# Altium schematic sheet 1_MCU.SchDoc: Untitled
size A3; CompanyName: Tsuru Robotics; Organization: Tsuru Robotics; Revision: -1
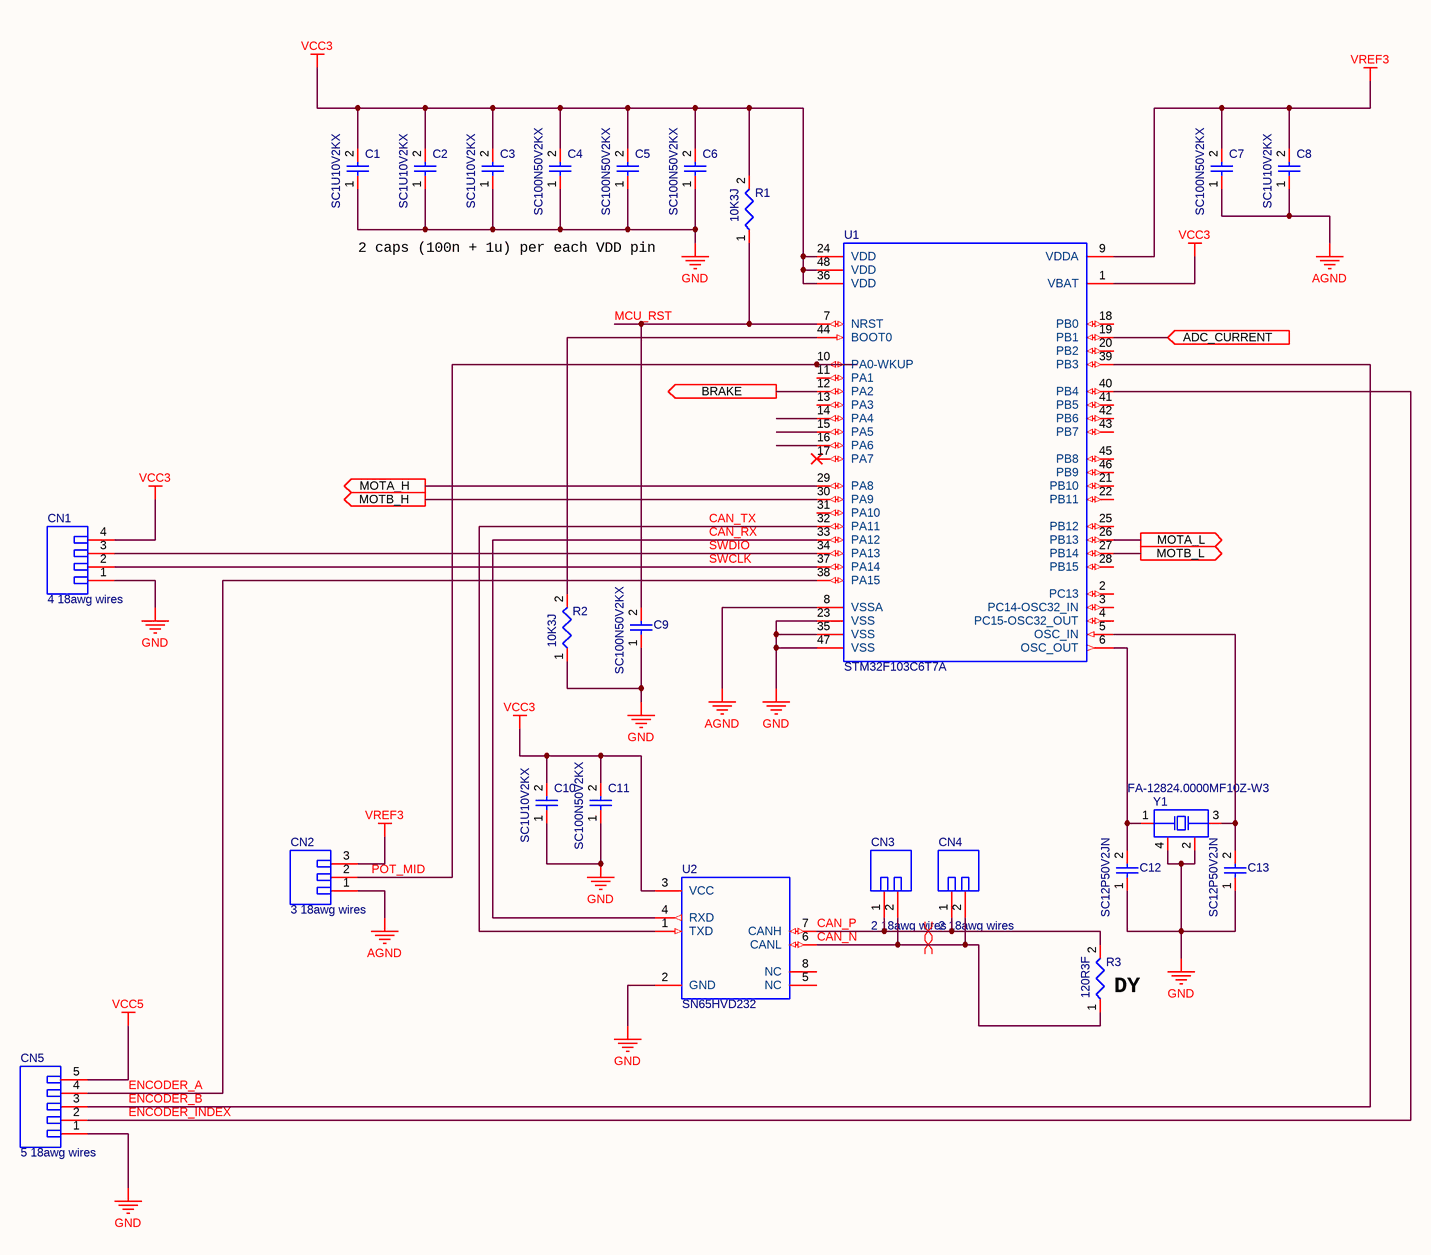
[diagram p0: 1_MCU.SchDoc]

## Parts
C1  SC1U10V2KX  [CAPC0402(1005)60_L]
C2  SC1U10V2KX  [CAPC0402(1005)60_L]
C3  SC1U10V2KX  [CAPC0402(1005)60_L]
C4  SC100N50V2KX  [CAPC0402(1005)60_L]
C5  SC100N50V2KX  [CAPC0402(1005)60_L]
C6  SC100N50V2KX  [CAPC0402(1005)60_L]
C7  SC100N50V2KX  [CAPC0402(1005)60_L]
C8  SC1U10V2KX  [CAPC0402(1005)60_L]
C9  SC100N50V2KX  [CAPC0402(1005)60_L]
C10  SC1U10V2KX  [CAPC0402(1005)60_L]
C11  SC100N50V2KX  [CAPC0402(1005)60_L]
C12  SC12P50V2JN  [CAPC0402(1005)33_L]
C13  SC12P50V2JN  [CAPC0402(1005)33_L]
CN1  4 18awg wires  [4PHEADERS-2D54]  (no BOM)
CN2  3 18awg wires  [3PHEADERS-2D54]  (no BOM)
CN3  2 18awg wires  [2PHEADERS-2D54]  (no BOM)
CN4  2 18awg wires  [2PHEADERS-2D54]  (no BOM)
CN5  5 18awg wires  [5PHEADERS-2D54]  (no BOM)
R1  10K3J  [RESC0603(1608)_L]
R2  10K3J  [RESC0603(1608)_L]
R3  120R3F  [RESC0603(1608)_L]
U1  STM32F103C6T7A  [TSQFP50P900X900X160-48L]
U2  SN65HVD232  [SOIC127P600X175-8L]
Y1  FA-12824.0000MF10Z-W3  [QRTZ-12mhz]

## Ports
ADC_CURRENT (in), BRAKE (out), MOTA_H (out), MOTA_L (out), MOTB_H (out), MOTB_L (out)

## Nets
AGND: C7.1 C8.1 CN2.1 U1.8(VSSA)
GND: C1.1 C2.1 C3.1 C4.1 C5.1 C6.1 C9.1 C10.1 C11.1 C12.1 C13.1 CN1.1 CN5.1 R2.1 U1.23(VSS) U1.35(VSS) U1.47(VSS) U2.2(GND) Y1.2(NC) Y1.4(NC)
VCC3: C1.2 C2.2 C3.2 C4.2 C5.2 C6.2 C10.2 C11.2 CN1.4 R1.2 U1.1(VBAT) U1.24(VDD) U1.36(VDD) U1.48(VDD) U2.3(VCC)
VCC5: CN5.5
VREF3: C7.2 C8.2 CN2.3 U1.9(VDDA)
ADC_CURRENT: U1.19(PB1) ; port ADC_CURRENT
BRAKE: U1.12(PA2) ; port BRAKE
CAN_N: CN3.2 CN4.2 R3.1 U2.6(CANL)
CAN_P: CN3.1 CN4.1 R3.2 U2.7(CANH)
CAN_RX: U1.33(PA12) U2.4(RXD)
CAN_TX: U1.32(PA11) U2.1(TXD)
ENCODER_A: CN5.4 U1.38(PA15)
ENCODER_B: CN5.3 U1.39(PB3)
ENCODER_INDEX: CN5.2 U1.40(PB4)
MCU_RST: C9.2 R1.1 U1.7(NRST)
MOTA_H: U1.29(PA8) ; port MOTA_H
MOTA_L: U1.26(PB13) ; port MOTA_L
MOTB_H: U1.30(PA9) ; port MOTB_H
MOTB_L: U1.27(PB14) ; port MOTB_L
POT_MID: CN2.2 U1.10(PA0-WKUP)
SWCLK: CN1.2 U1.37(PA14)
SWDIO: CN1.3 U1.34(PA13)
NetC12_2: C12.2 U1.6(OSC_OUT) Y1.1(X1)
NetC13_2: C13.2 U1.5(OSC_IN) Y1.3(X2)
NetR2_2: R2.2 U1.44(BOOT0)

Not connected (* = marked no-connect by the designer): U1 2(PC13) 3(PC14-OSC32_IN) 4(PC15-OSC32_OUT) 11(PA1) 13(PA3) 14(PA4) 15(PA5) 16(PA6) 17(PA7)* 18(PB0) 20(PB2) 21(PB10) 22(PB11) 25(PB12) 28(PB15) 31(PA10) 41(PB5) 42(PB6) 43(PB7) 45(PB8) 46(PB9); U2 5(NC) 8(NC)

## Layout directives
differential pair: CAN_P
differential pair; differential pair class *: CAN_N

## Notes on the sheet
- 2 caps (100n + 1u) per each VDD pin
- (near R3) DY
- Title
- Size:
- Date:
- A3
- Number:
- Time:
- Revision:
- Sheet
- of
- File:

## Library data of the parts
C1-C3 C8 C10 = CAP(0402)1UF10V: CAP 1uF 10V ±10% 0402 (1005 Metric) Thickness 0.6mm SMD
C4-C7 C9 C11 = CAP(0402)100nF50V: CAP 100nF 50V ±10% 0402 (1005 Metric) Thickness 0.6mm SMD
C12 C13 = CAP12pF: CAP 12pF 50V ±5% 0402 (1005 Metric) Thickness 0.33mm SMD
CN1 = 4PIN-CN: 4 holes for 18awg wire; Manufacturer: JST; Datasheet URL: http://www.jst-mfg.com/product/pdf/eng/eGH.pdf; Package Reference: JST-BM04B-GHS-TBT
CN2 = 3PIN-CN: 3 holes for 18awg wire; Manufacturer: JST; Datasheet URL: http://www.jst-mfg.com/product/pdf/eng/eGH.pdf; Package Reference: JST-BM04B-GHS-TBT
CN3 CN4 = 2PIN-CN: 2 holes for 18awg wire; Manufacturer: JST; Datasheet URL: http://www.jst-mfg.com/product/pdf/eng/eGH.pdf; Package Reference: JST-BM04B-GHS-TBT
CN5 = 5PIN-CN: 5 holes for 18awg wire; Manufacturer: JST; Datasheet URL: http://www.jst-mfg.com/product/pdf/eng/eGH.pdf; Package Reference: JST-BM04B-GHS-TBT
R1 R2 = RES0(0603)_10K: 10K 0.1W 5% 0603 (1608 Metric)  SMD
R3 = RES0(0603)_120R: 100R 0.1W 1% 0603 (1608 Metric)  SMD
U1 = STM32F103C6T7A: ARM® Cortex®-M3 STM32F1 Microcontroller IC 32-Bit 72MHz 32KB 48-LFQP (7x7); Supply Voltage(Vcc) min (V): 2; FLASH Size (Prog) (kB): 512; Operating Frequency(F) (Processor speed) (MHz): 80; Internal RAM Size (kB): 160; Packing: Tape and Reel; Core: ARM Cortex-M4; I/Os: 38; Case/Package: UFQFN-48; RoHS Compliant: Yes; Mounting Technology: Surface Mount; ComponentLink1Description: Manufacturer URL; ComponentLink1URL: http://www.st.com/; Package Reference: UFQFPN48; ComponentLink2Description: Datasheet; ComponentLink2URL: http://www.st.com/st-web-ui/static/active/en/resource/technical/document/datasheet/CD00161566.pdf; Package Description: 48-Pin Ultra Thin Fine Pitch Quad Flat No-Lead, 7 x 7 x 0.6 mm Body, 0.5 mm Pitch, Exposed Pad
U2 = CAN_SN65HVD232D: IC CAN TRANSCEIVER 8-SOIC
Y1 = XTAL-1-3-4: Crystal, 24 MHz, +/- 10 ppm, -20 to 75 degC, 4-Pin SMD, RoHS, Tape and Reel; Frequency Tolerance: 10ppm; Load Capacitance: 12pF; Frequency: 24MHz; ESR (Equivalent Series Resistance): 80R; Length: 0.079inch; Frequency Stability: 10ppm; Width: 0.063inch; Mounting Technology: SMT; Tolerance: 10ppm; RoHS Compliant: Yes; Termination: SMD/SMT; Number of Pins: 4; Package Quantity: 250; Max Operating Temperature: 75°C; Packaging: Tape and Reel; Radiation Hardening: No; Mount: Surface Mount; Lead Free: Lead Free; Case/Package: SMD/SMT; Height: 0.02inch; Min Operating Temperature: -20°C